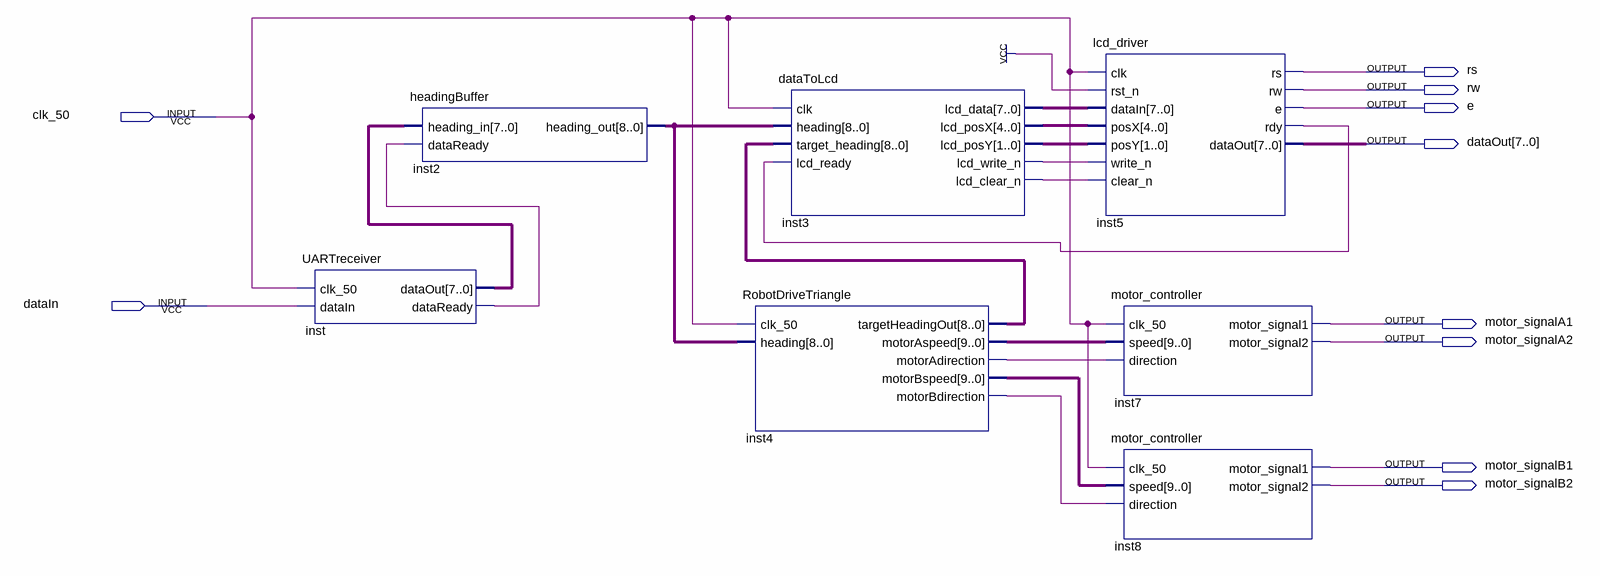
[diagram p0: schematic sheet]
// Quartus schematic gyro.bdf as structural Verilog: 7 symbols, 10 pins
module gyro (
  input  clk_50,
  input  dataIn,
  output rs,
  output rw,
  output e,
  output [7:0] dataOut,
  output motor_signalA1,
  output motor_signalA2,
  output motor_signalB1,
  output motor_signalB2
);

  wire inst3_lcd_clear_n, inst3_lcd_write_n, inst4_motoradirection, inst4_motorbdirection, inst5_rdy,
       inst_dataready;
  wire [1:0] inst3_lcd_posy;
  wire [4:0] inst3_lcd_posx;
  wire [7:0] inst3_lcd_data, inst_dataout;
  wire [8:0] inst2_heading_out, inst4_targetheadingout;
  wire [9:0] inst4_motoraspeed, inst4_motorbspeed;

  UARTreceiver inst (.clk_50(clk_50), .dataIn(dataIn), .dataOut(inst_dataout), .dataReady(inst_dataready));
  headingBuffer inst2 (.heading_in(inst_dataout), .dataReady(inst_dataready), .heading_out(inst2_heading_out));
  dataToLcd inst3 (
    .clk(clk_50), .heading(inst2_heading_out), .target_heading(inst4_targetheadingout),
    .lcd_ready(inst5_rdy), .lcd_data(inst3_lcd_data), .lcd_posX(inst3_lcd_posx), .lcd_posY(inst3_lcd_posy),
    .lcd_write_n(inst3_lcd_write_n), .lcd_clear_n(inst3_lcd_clear_n));
  RobotDriveTriangle inst4 (
    .clk_50(clk_50), .heading(inst2_heading_out), .targetHeadingOut(inst4_targetheadingout),
    .motorAspeed(inst4_motoraspeed), .motorAdirection(inst4_motoradirection),
    .motorBspeed(inst4_motorbspeed), .motorBdirection(inst4_motorbdirection));
  lcd_driver inst5 (
    .clk(clk_50), .rst_n(1'b1), .dataIn(inst3_lcd_data), .posX(inst3_lcd_posx), .posY(inst3_lcd_posy),
    .write_n(inst3_lcd_write_n), .clear_n(inst3_lcd_clear_n), .rs(rs), .rw(rw), .e(e), .rdy(inst5_rdy),
    .dataOut(dataOut));
  motor_controller inst7 (
    .clk_50(clk_50), .speed(inst4_motoraspeed), .direction(inst4_motoradirection),
    .motor_signal1(motor_signalA1), .motor_signal2(motor_signalA2));
  motor_controller inst8 (
    .clk_50(clk_50), .speed(inst4_motorbspeed), .direction(inst4_motorbdirection),
    .motor_signal1(motor_signalB1), .motor_signal2(motor_signalB2));
endmodule
